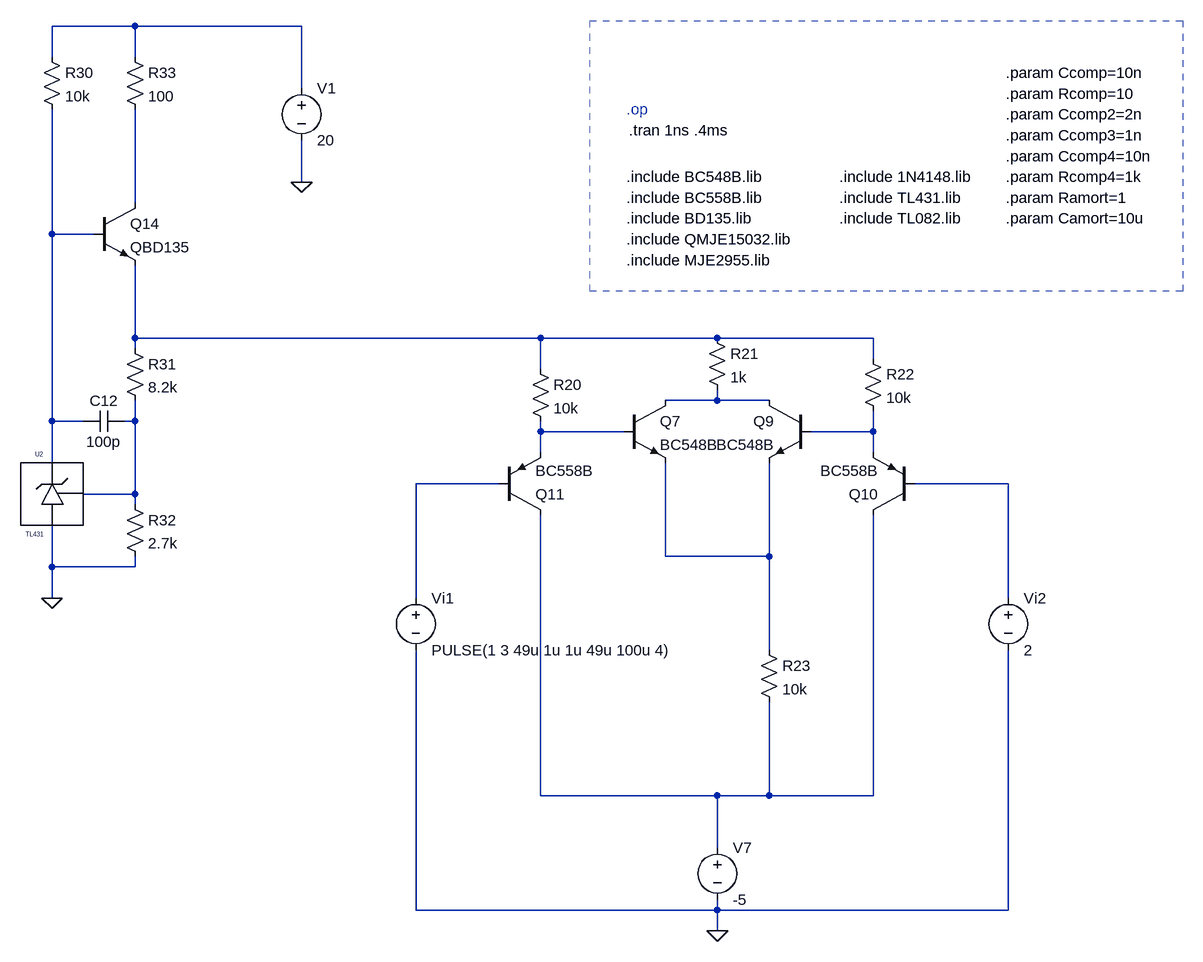
[diagram p0: schematic power_supply_P03.0.asc]
power_supply_P03.0.asc, the LTspice schematic file:
Version 4
SHEET 1 3040 1240
WIRE -48 -496 -176 -496
WIRE 208 -496 -48 -496
WIRE -176 -448 -176 -496
WIRE -48 -448 -48 -496
WIRE 208 -400 208 -496
WIRE -48 -288 -48 -368
WIRE 208 -256 208 -320
WIRE -48 -224 -48 -288
WIRE -176 -176 -176 -368
WIRE -112 -176 -176 -176
WIRE -48 -48 -48 -128
WIRE -48 -16 -48 -48
WIRE 288 -16 -48 -16
WIRE 576 -16 288 -16
WIRE 848 -16 576 -16
WIRE 1088 -16 848 -16
WIRE -48 0 -48 -16
WIRE 1088 16 1088 -16
WIRE -176 32 -176 -176
WIRE 576 32 576 -16
WIRE 848 80 848 64
WIRE 848 80 768 80
WIRE 928 80 848 80
WIRE -176 112 -176 32
WIRE -128 112 -176 112
WIRE -48 112 -48 80
WIRE -48 112 -64 112
WIRE 576 128 576 112
WIRE 656 128 576 128
WIRE 704 128 656 128
WIRE 1040 128 992 128
WIRE 1088 128 1088 96
WIRE 1088 128 1040 128
WIRE 576 160 576 128
WIRE 1088 160 1088 128
WIRE -176 176 -176 112
WIRE 512 208 384 208
WIRE 1296 208 1152 208
WIRE -48 224 -48 112
WIRE -48 224 -128 224
WIRE -48 240 -48 224
WIRE 768 272 768 176
WIRE 768 320 768 272
WIRE 928 320 928 176
WIRE 928 320 768 320
WIRE -176 336 -176 272
WIRE -48 336 -48 320
WIRE -48 336 -176 336
WIRE -176 384 -176 336
WIRE 384 384 384 208
WIRE 1296 384 1296 208
WIRE 928 464 928 320
WIRE 576 688 576 256
WIRE 848 688 576 688
WIRE 928 688 928 544
WIRE 928 688 848 688
WIRE 1088 688 1088 256
WIRE 1088 688 928 688
WIRE 848 768 848 688
WIRE 384 864 384 464
WIRE 848 864 848 848
WIRE 848 864 384 864
WIRE 1296 864 1296 464
WIRE 1296 864 848 864
WIRE 848 896 848 864
FLAG 208 -256 0
FLAG -176 384 0
FLAG 848 896 0
DATAFLAG -176 -176 ""
DATAFLAG -48 -288 ""
DATAFLAG 656 128 ""
DATAFLAG 768 272 ""
DATAFLAG 928 80 ""
DATAFLAG 1040 128 ""
DATAFLAG -48 -48 "-Ie(Q14)"
DATAFLAG -176 32 "Ix(U2:CATHODE)"
DATAFLAG 288 -16 "$"
SYMBOL res 560 16 R0
SYMATTR InstName R20
SYMATTR Value 10k
SYMBOL npn 704 80 R0
SYMATTR InstName Q7
SYMATTR Value BC548B
SYMBOL npn 992 80 M0
SYMATTR InstName Q9
SYMATTR Value BC548B
SYMBOL res 832 -32 R0
SYMATTR InstName R21
SYMATTR Value 1k
SYMBOL res 912 448 R0
SYMATTR InstName R23
SYMATTR Value 10k
SYMBOL res 1072 0 R0
SYMATTR InstName R22
SYMATTR Value 10k
SYMBOL pnp 512 256 M180
SYMATTR InstName Q11
SYMATTR Value BC558B
SYMBOL pnp 1152 256 R180
SYMATTR InstName Q10
SYMATTR Value BC558B
SYMBOL voltage 208 -416 R0
SYMATTR InstName V1
SYMATTR Value 20
SYMBOL res -192 -464 R0
SYMATTR InstName R30
SYMATTR Value 10k
SYMBOL npn -112 -224 R0
SYMATTR InstName Q14
SYMATTR Value QBD135
SYMBOL res -64 -16 R0
SYMATTR InstName R31
SYMATTR Value 8.2k
SYMBOL res -64 224 R0
SYMATTR InstName R32
SYMATTR Value 2.7k
SYMBOL cap -64 96 R90
WINDOW 0 0 32 VBottom 2
WINDOW 3 32 32 VTop 2
SYMATTR InstName C12
SYMATTR Value 100p
SYMBOL TL431 -176 224 M0
SYMATTR InstName U2
SYMBOL voltage 848 752 R0
SYMATTR InstName V7
SYMATTR Value -5
SYMBOL res -64 -464 R0
SYMATTR InstName R33
SYMATTR Value 100
SYMBOL voltage 384 368 R0
SYMATTR InstName Vi1
SYMATTR Value PULSE(1 3 49u 1u 1u 49u 100u 4)
SYMBOL voltage 1296 368 R0
SYMATTR InstName Vi2
SYMATTR Value 2
TEXT 708 -232 Left 2 !.include BC558B.lib
TEXT 1036 -200 Left 2 !.include TL082.lib
TEXT 708 -264 Left 2 !.include BC548B.lib
TEXT 708 -136 Left 2 !.include MJE2955.lib
TEXT 708 -200 Left 2 !.include BD135.lib
TEXT 1036 -264 Left 2 !.include 1N4148.lib
TEXT 1036 -232 Left 2 !.include TL431.lib
TEXT 708 -168 Left 2 !.include QMJE15032.lib
TEXT 708 -368 Left 2 ;.op
TEXT 1292 -424 Left 2 !.param Ccomp=10n
TEXT 1292 -392 Left 2 !.param Rcomp=10
TEXT 1292 -360 Left 2 !.param Ccomp2=2n
TEXT 1292 -328 Left 2 !.param Ccomp3=1n
TEXT 1292 -296 Left 2 !.param Ccomp4=10n
TEXT 1292 -232 Left 2 !.param Ramort=1
TEXT 1292 -200 Left 2 !.param Camort=10u
TEXT 1292 -264 Left 2 !.param Rcomp4=1k
TEXT 712 -336 Left 2 !.tran 1ns .4ms
RECTANGLE Normal 1564 -88 652 -504 1

The netlist it stands for:
* power_supply_P03.0.asc
R20 N004 N007 10k
Q7 N005 N007 N011 0 BC548B
Q9 N005 N008 N011 0 BC548B
R21 N004 N005 1k
R23 N011 N012 10k
R22 N004 N008 10k
Q11 N012 N009 N007 0 BC558B
Q10 N012 N010 N008 0 BC558B
V1 N001 0 20
R30 N001 N003 10k
Q14 N002 N003 N004 0 QBD135
R31 N004 N006 8.2k
R32 N006 0 2.7k
C12 N006 N003 100p
XU2 N003 0 N006 TL431  ; pins CATHODE ANODE REF
V7 N012 0 -5
R33 N001 N002 100
Vi1 N009 0 PULSE(1 3 49u 1u 1u 49u 100u 4)
Vi2 N010 0 2
.model NPN NPN
.model PNP PNP
.lib standard.bjt
.include BC558B.lib
.include TL082.lib
.include BC548B.lib
.include MJE2955.lib
.include BD135.lib
.include 1N4148.lib
.include TL431.lib
.include QMJE15032.lib
* .op
.param Ccomp=10n
.param Rcomp=10
.param Ccomp2=2n
.param Ccomp3=1n
.param Ccomp4=10n
.param Ramort=1
.param Camort=10u
.param Rcomp4=1k
.tran 1ns .4ms
.lib tl431.lib
.backanno
.end